# EAGLE design Rainer - V0 (EAGLE 7.3.0)

## Sheet 1 of 2
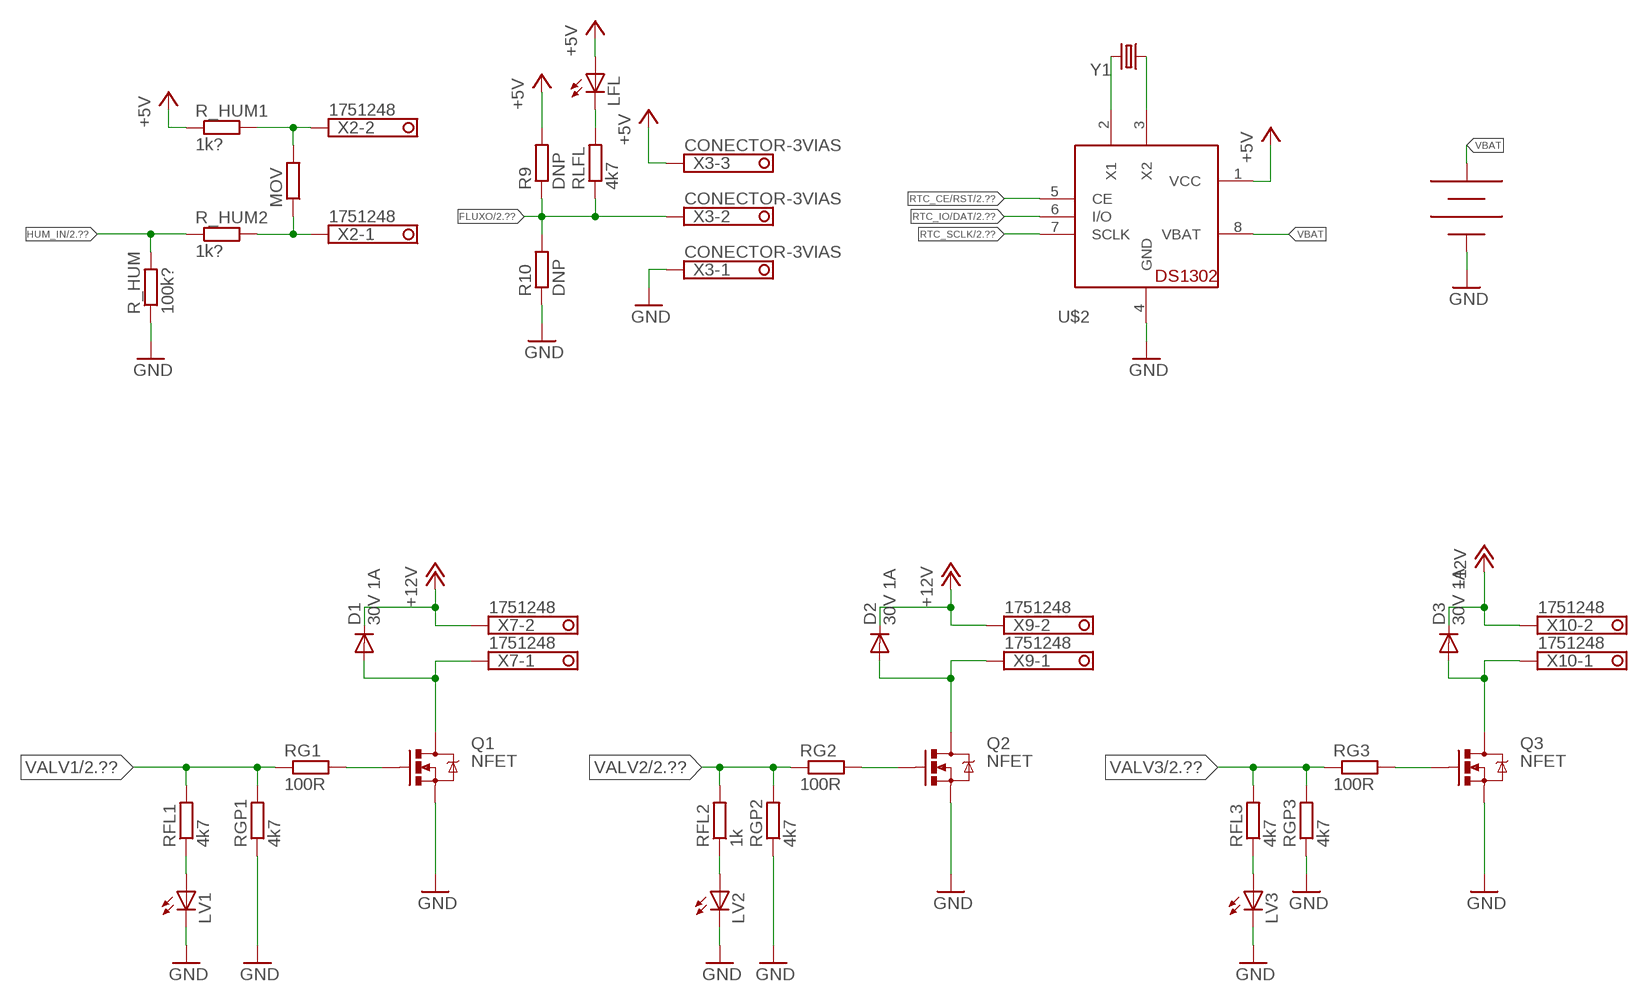
[diagram p0: schematic, sheet 1]

### Parts
D1  30V 1A  DIODE-DO214AC  [DO214AC]
D2  30V 1A  DIODE-DO214AC  [DO214AC]
D3  30V 1A  DIODE-DO214AC  [DO214AC]
LFL  LEDCHIP-LED0603  [CHIP-LED0603]
LV1  LEDCHIP-LED0603  [CHIP-LED0603]
LV2  LEDCHIP-LED0603  [CHIP-LED0603]
LV3  LEDCHIP-LED0603  [CHIP-LED0603]
MOV  R-EU_0207/7  [0207/7]
Q1  NFET  MOSFET-NCHANNELBSS138  [SOT23]
Q2  NFET  MOSFET-NCHANNELBSS138  [SOT23]
Q3  NFET  MOSFET-NCHANNELBSS138  [SOT23]
R9  DNP  R-EU_R0603  [R0603]
R10  DNP  R-EU_R0603  [R0603]
R_HUM  100k?  R-EU_R0603  [R0603]
R_HUM1  1k?  R-EU_R0603  [R0603]
R_HUM2  1k?  R-EU_R0603  [R0603]
RFL1  4k7  R-EU_R0603  [R0603]
RFL2  1k  R-EU_R0603  [R0603]
RFL3  4k7  R-EU_R0603  [R0603]
RG1  100R  R-EU_R0603  [R0603]
RG2  100R  R-EU_R0603  [R0603]
RG3  100R  R-EU_R0603  [R0603]
RGP1  4k7  R-EU_R0603  [R0603]
RGP2  4k7  R-EU_R0603  [R0603]
RGP3  4k7  R-EU_R0603  [R0603]
RLFL  4k7  R-EU_R0603  [R0603]
U$2  DS1302  [DIL08-ROUND]
U$4  CR2032  [CR2032-A]
X2  1751248  [1751248]
X3  CONECTOR-3VIAS  [3.5MM-3VIAS]
X7  1751248  [1751248]
X9  1751248  [1751248]
X10  1751248  [1751248]
Y1  CRYSTAL  [TC26V]

### Nets
+5V: LFL.A R9.2 R_HUM1.1 U$2.1(VCC) X3.3 ; also sheet 2
+12V: D1.C D2.C D3.C X7.2 X9.2 X10.2 ; also sheet 2
FLUXO: R9.1 R10.2 RLFL.1 X3.2 ; also sheet 2
GND: LV1.C LV2.C LV3.C Q1.2(S) Q2.2(S) Q3.2(S) R10.1 R_HUM.1 RGP1.1 RGP2.1 RGP3.1 U$2.4(GND) U$4.P$1 X3.1 ; also sheet 2
HUM_IN: R_HUM2.1 R_HUM.2 ; also sheet 2
N$2: MOV.2 R_HUM1.2 X2.2
N$4: MOV.1 R_HUM2.2 X2.1
N$5: LFL.C RLFL.2
N$6: Q1.1(G) RG1.2
N$8: U$2.2(X1) Y1.2
N$9: U$2.3(X2) Y1.1
N$10: D1.A Q1.3(D) X7.1
N$12: Q2.1(G) RG2.2
N$14: D2.A Q2.3(D) X9.1
N$15: Q3.1(G) RG3.2
N$17: D3.A Q3.3(D) X10.1
N$24: LV3.A RFL3.1
N$26: LV2.A RFL2.1
N$28: LV1.A RFL1.1
RTC_CE/RST: U$2.5(CE) ; also sheet 2
RTC_IO/DAT: U$2.6(I/O) ; also sheet 2
RTC_SCLK: U$2.7(SCLK) ; also sheet 2
VALV1: RFL1.2 RG1.1 RGP1.2 ; also sheet 2
VALV2: RFL2.2 RG2.1 RGP2.2 ; also sheet 2
VALV3: RFL3.2 RG3.1 RGP3.2 ; also sheet 2
VBAT: U$2.8(VBAT) U$4.P$2

## Sheet 2 of 2
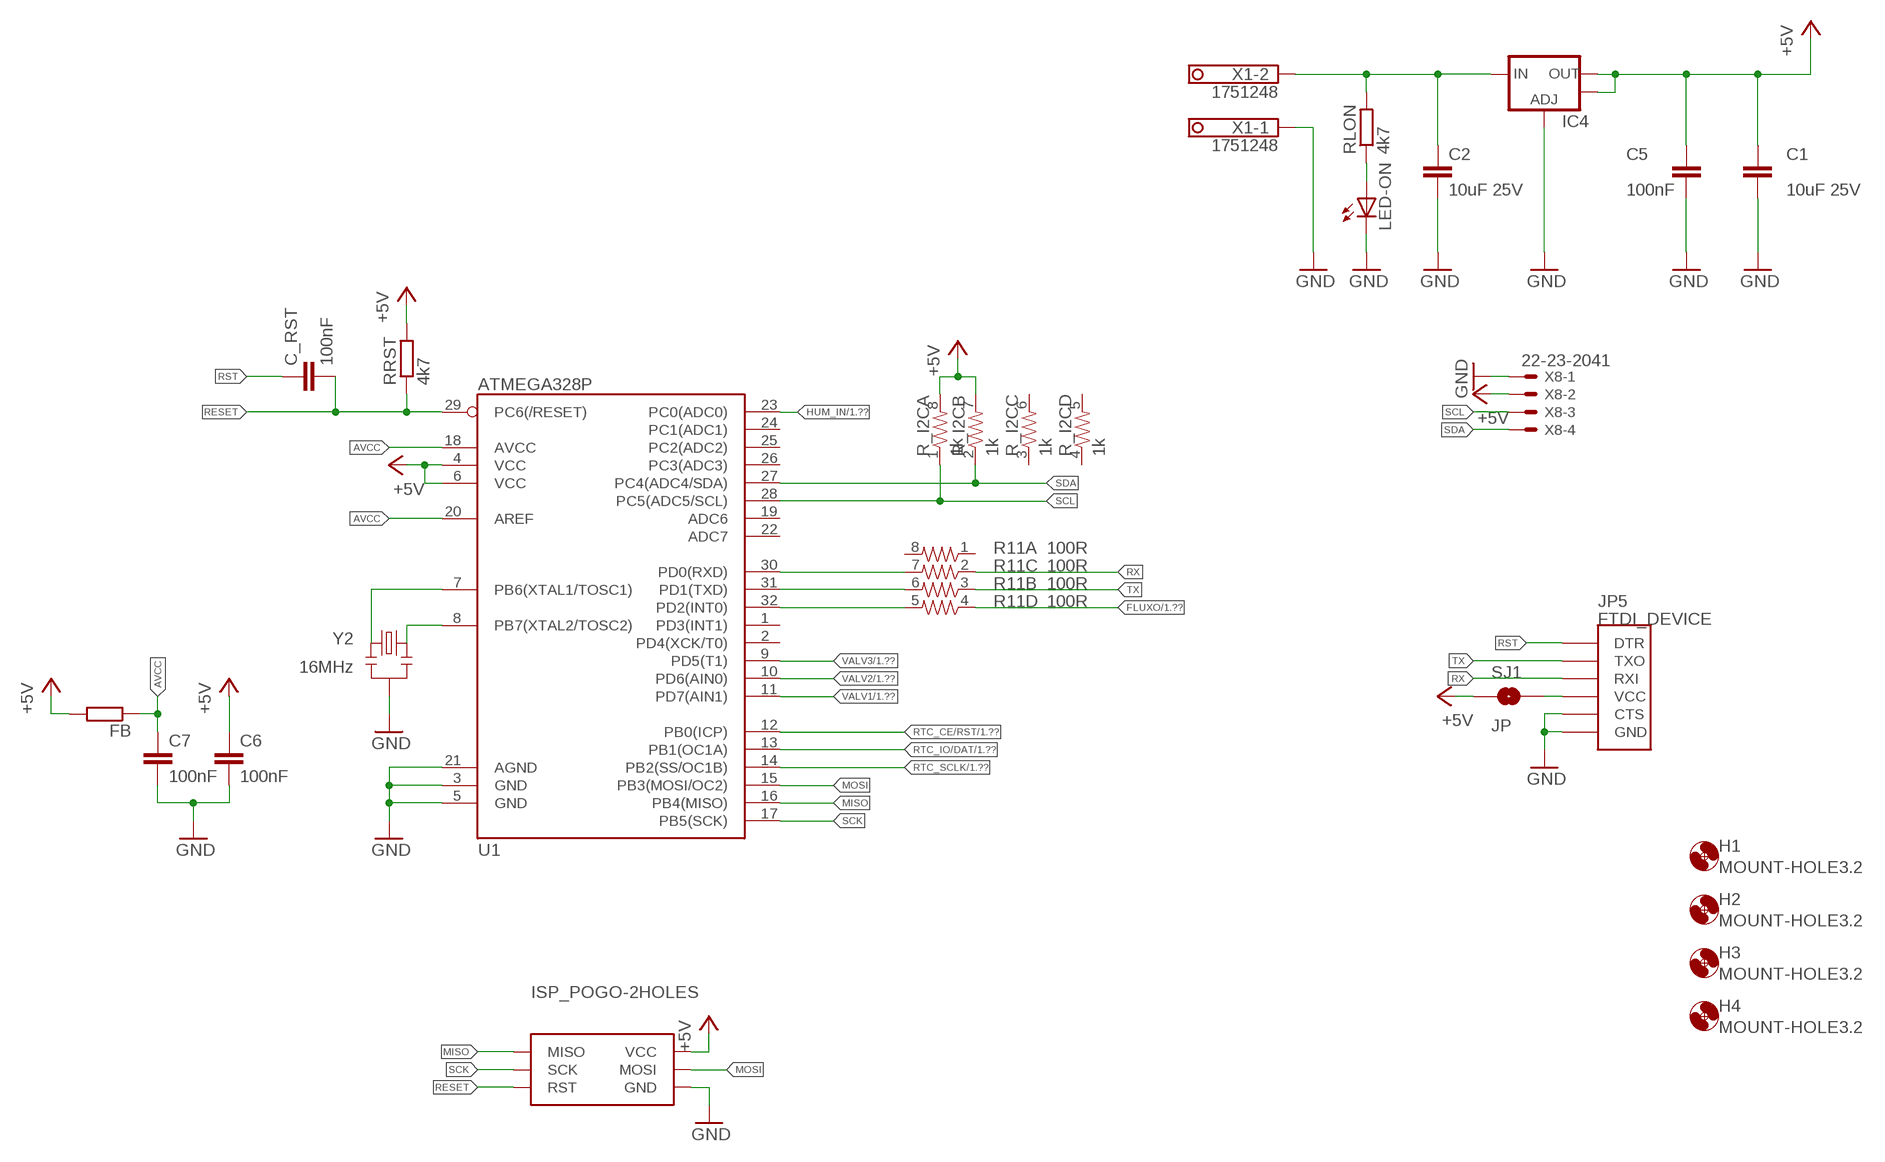
[diagram p1: schematic, sheet 2]

### Parts
C1  10uF 25V  C-EUC1210  [C1210]
C2  10uF 25V  C-EUC1210  [C1210]
C5  100nF  C-EUC0603  [C0603]
C6  100nF  C-EUC0603  [C0603]
C7  100nF  C-EUC0603  [C0603]
C_RST  100nF  C-EUC0603  [C0603]
FB  R-EU_R0603  [R0603]
H1  MOUNT-HOLE3.2  [3,2]
H2  MOUNT-HOLE3.2  [3,2]
H3  MOUNT-HOLE3.2  [3,2]
H4  MOUNT-HOLE3.2  [3,2]
IC4  V_REG_LM1117SOT223  [SOT223]
JP5  FTDI_DEVICE  [FTDI_DEVICE_SIDE]
LED-ON  LEDCHIP-LED0603  [CHIP-LED0603]
R11  100R  RESISTOR-ARRAY0603-ARV  [0603-ARV]
R_I2C  1k  RESISTOR-ARRAY0603-ARV  [0603-ARV]
RLON  4k7  R-EU_R0603  [R0603]
RRST  4k7  R-EU_R0603  [R0603]
SJ1  JP  SOLDERJUMPER-OLDNC2  [SJ_2S-NOTRACE]
U1  ATMEGA328P  ATMEGA328_SMT  [TQFP32-08]
U$1  ISP_POGO-2HOLES  [ISP_POGO]
X1  1751248  [1751248]
X8  22-23-2041  [22-23-2041]
Y2  16MHz  RESONATOR16MHZ  [RESONATOR-SMD]

### Nets
+5V: C1.1 C5.1 C6.1 FB.2 IC4.2(OUT) IC4.4(OUT) R_I2C.7 R_I2C.8 RRST.2 SJ1.1 U1.4(VCC) U1.6(VCC) U$1.VCC X8.2 ; also sheet 1
+12V: C2.1 IC4.3(IN) RLON.2 X1.2 ; also sheet 1
AVCC: C7.1 FB.1 U1.18(AVCC) U1.20(AREF)
FLUXO: R11.4 ; also sheet 1
GND: C1.2 C2.2 C5.2 C6.2 C7.2 IC4.1(ADJ) JP5.P$5(CTS) JP5.P$6(GND) LED-ON.C U1.3(GND) U1.5(GND) U1.21(AGND) U$1.GND X1.1 X8.1 Y2.2 ; also sheet 1
HUM_IN: U1.23(PC0(ADC0)) ; also sheet 1
MISO: U1.16(PB4(MISO)) U$1.MISO
MOSI: U1.15(PB3(MOSI/OC2)) U$1.MOSI
N$1: U1.7(PB6(XTAL1/TOSC1)) Y2.1
N$3: U1.8(PB7(XTAL2/TOSC2)) Y2.3
N$7: LED-ON.A RLON.1
N$11: R11.7 U1.30(PD0(RXD))
N$19: JP5.P$4(VCC) SJ1.2
N$21: R11.6 U1.31(PD1(TXD))
N$22: R11.5 U1.32(PD2(INT0))
RESET: C_RST.2 RRST.1 U1.29(PC6(/RESET)) U$1.RST
RST: C_RST.1 JP5.P$1(DTR)
RTC_CE/RST: U1.12(PB0(ICP)) ; also sheet 1
RTC_IO/DAT: U1.13(PB1(OC1A)) ; also sheet 1
RTC_SCLK: U1.14(PB2(SS/OC1B)) ; also sheet 1
RX: JP5.P$3(RXI) R11.2
SCK: U1.17(PB5(SCK)) U$1.SCK
SCL: R_I2C.1 U1.28(PC5(ADC5/SCL)) X8.3
SDA: R_I2C.2 U1.27(PC4(ADC4/SDA)) X8.4
TX: JP5.P$2(TXO) R11.3
VALV1: U1.11(PD7(AIN1)) ; also sheet 1
VALV2: U1.10(PD6(AIN0)) ; also sheet 1
VALV3: U1.9(PD5(T1)) ; also sheet 1
Unconnected: R11.1 R11.8 R_I2C.3 R_I2C.4 R_I2C.5 R_I2C.6 U1.1(PD3(INT1)) U1.2(PD4(XCK/T0)) U1.19(ADC6) U1.22(ADC7) U1.24(PC1(ADC1)) U1.25(PC2(ADC2)) U1.26(PC3(ADC3))

## Library data of the parts
C1 C2 C5-C7 C_RST = wes:C-EU: CAPACITOR, European symbol
D1-D3 = diode:DIODE-: DIODE
FB R9 R10 R_HUM R_HUM1 R_HUM2 RFL1-RFL3 RG1-RG3 RGP1-RGP3 RLFL RLON RRST = wes:R-EU_: RESISTOR, European symbol
H1-H4 = holes:MOUNT-HOLE: MOUNTING HOLE with drill center marker
IC4 = SparkFun-PowerIC:V_REG_LM1117: Voltage Regulator LM1117 Standard adjustable voltage regulator but in SMD form. Spark Fun Electronics SKU : COM-00595
JP5 = SparkFun-Connectors:FTDI_DEVICE: Connector which mates to FTDI basic or FTDI cable.
LED-ON LFL LV1-LV3 = led:LED: LED OSRAM: - CHIPLED LG R971, LG N971, LY N971, LG Q971, LY Q971, LO R971, LY R971 LH N974, LH R974 LS Q976, LO Q976, LY Q976 LO Q996 - Hyper CHIPLED LW Q18S LB Q993, LB Q99A, LB R99A - SideLED LS A670, LO A670, LY A670, LG A670, LP A670 LB A673, LV A673, LT A673, LW A673 LH A674 LY A675 LS A676, LA A676, LO A676, LY A676, LW A676 LS A679, LY A679, LG A679 - Hyper Micro SIDELED® LS Y876, LA Y876, LO Y876, LY Y876 LT Y87S - SmartLED LW L88C, LW L88S LB L89C, LB L89S, LG L890 LS L89K, LO L89K, LY L89K LS L896, LA L896, LO L896, LY L896 - TOPLED LS T670, LO T670, LY T670, LG T670, LP T670 LSG T670, LSP T670, LSY T670, LOP T670, LYG T670 LG T671, LOG T671, LSG T671 LB T673, LV T673, LT T673, LW T673 LH T674 LS T676, LA T676, LO T676, LY T676, LB T676, LH T676, LSB T676, LW T676 LB T67C, LV T67C, LT T67C, LS T67K, LO T67K, LY T67K, LW E67C LS E67B, LA E67B, LO E67B, LY E67B, LB E67C, LV E67C, LT E67C LW T67C LS T679, LY T679, LG T679 LS T770, LO T770, LY T770, LG T770, LP T770 LB T773, LV T773, LT T773, LW T773 LH T774 LS E675, LA E675, LY E675, LS T675 LS T776, LA T776, LO T776, LY T776, LB T776 LHGB T686 LT T68C, LB T68C - Hyper Mini TOPLED® LB M676 - Mini TOPLED Santana® LG M470 LS M47K, LO M47K, LY M47K Source: http://www.osram.convergy.de LUXEON: - LUMILED® LXK2-PW12-R00, LXK2-PW12-S00, LXK2-PW14-U00, LXK2-PW14-V00 LXK2-PM12-R00, LXK2-PM12-S00, LXK2-PM14-U00 LXK2-PE12-Q00, LXK2-PE12-R00, LXK2-PE12-S00, LXK2-PE14-T00, LXK2-PE14-U00 LXK2-PB12-K00, LXK2-PB12-L00, LXK2-PB12-M00, LXK2-PB14-N00, LXK2-PB14-P00, LXK2-PB14-Q00 LXK2-PR12-L00, LXK2-PR12-M00, LXK2-PR14-Q00, LXK2-PR14-R00 LXK2-PD12-Q00, LXK2-PD12-R00, LXK2-PD12-S00 LXK2-PH12-R00, LXK2-PH12-S00 LXK2-PL12-P00, LXK2-PL12-Q00, LXK2-PL12-R00 Source: www.luxeon.com KINGBRIGHT: KA-3528ASYC Source: www.kingbright.com
MOV = rcl:R-EU_: RESISTOR, European symbol
Q1-Q3 = SparkFun-DiscreteSemi:MOSFET-NCHANNEL: Common NMOSFET Parts MFG P/N Store ID Prod ID FDD8780 TRANS-09984 SI7820DN TRANS-11055 FDS6630A IC-08089 2N7002PW TRANS-11151 FQP30N06L COM-10213 TRANS-10060 BSS123LT1G TRANS-08345 BSS138 TRANS-00830 BS170 2N7000; PROD_ID: TRANS-00830
R11 R_I2C = SparkFun-Passives:RESISTOR-ARRAY: Array Chip Resistor Source: RS Component / Phycomp
SJ1 = SparkFun-Passives:SOLDERJUMPER-OLD: Solder Jumper Standard SMD solder jumper. Used to automate production. Two varients : Normally Open and Normally Closed are the same, but have different paste layers. NC will have a large amount of paste and should jumper during reflow.
U1 = SparkFun-DigitalIC:ATMEGA328_SMT: 32-Pin Atmega328 part Commonly used on Arduino compatible boards Available in QFP and QFN packages TQFP is IC-09069 QFN is non-stock; PROD_ID: IC-09069
U$1 = wes:ISP_POGO
U$2 = adafruit:DS1302: DS1302 - Real time clock with supercap trickle charger
U$4 = wes:CR2032
X1 X2 X7 X9 X10 = wes:1751248: MKDS 1/ 2-3,5 Printklemme Nennstrom: 10 A Bemessungsspannung: 160 V Raster: 3,5 mm Polzahl: 2 Montageart: Löten Anschlussart: Schraubanschluss Anschlussrichtung vom Leiter zur Platine: 0° Source: http://eshop.phoenixcontact.com .. 1751248.pdf; OC_FARNELL: unknown; OC_NEWARK: unknown
X3 = wes:CONECTOR-3VIAS: MKDS 1/ 2-3,5 Printklemme Nennstrom: 10 A Bemessungsspannung: 160 V Raster: 3,5 mm Polzahl: 2 Montageart: Löten Anschlussart: Schraubanschluss Anschlussrichtung vom Leiter zur Platine: 0° Source: http://eshop.phoenixcontact.com .. 1751248.pdf
X8 = con-molex:22-23-2041: .100" (2.54mm) Center Header - 4 Pin; MF: MOLEX; MPN: 22-23-2041; OC_FARNELL: 1462920; OC_NEWARK: 38C0355
Y1 = SparkFun-FreqCtrl:CRYSTAL: Various standard crystals. Proven footprints. Spark Fun Electronics SKU : COM-00534
Y2 = SparkFun-FreqCtrl:RESONATOR: Resonator Small SMD resonator. Used, eg, on the Arduino Pro/ Pro Mini boards. 8MHz- XTAL-08895 16MHz- XTAL-08900; PROD_ID: XTAL-08900

## Board
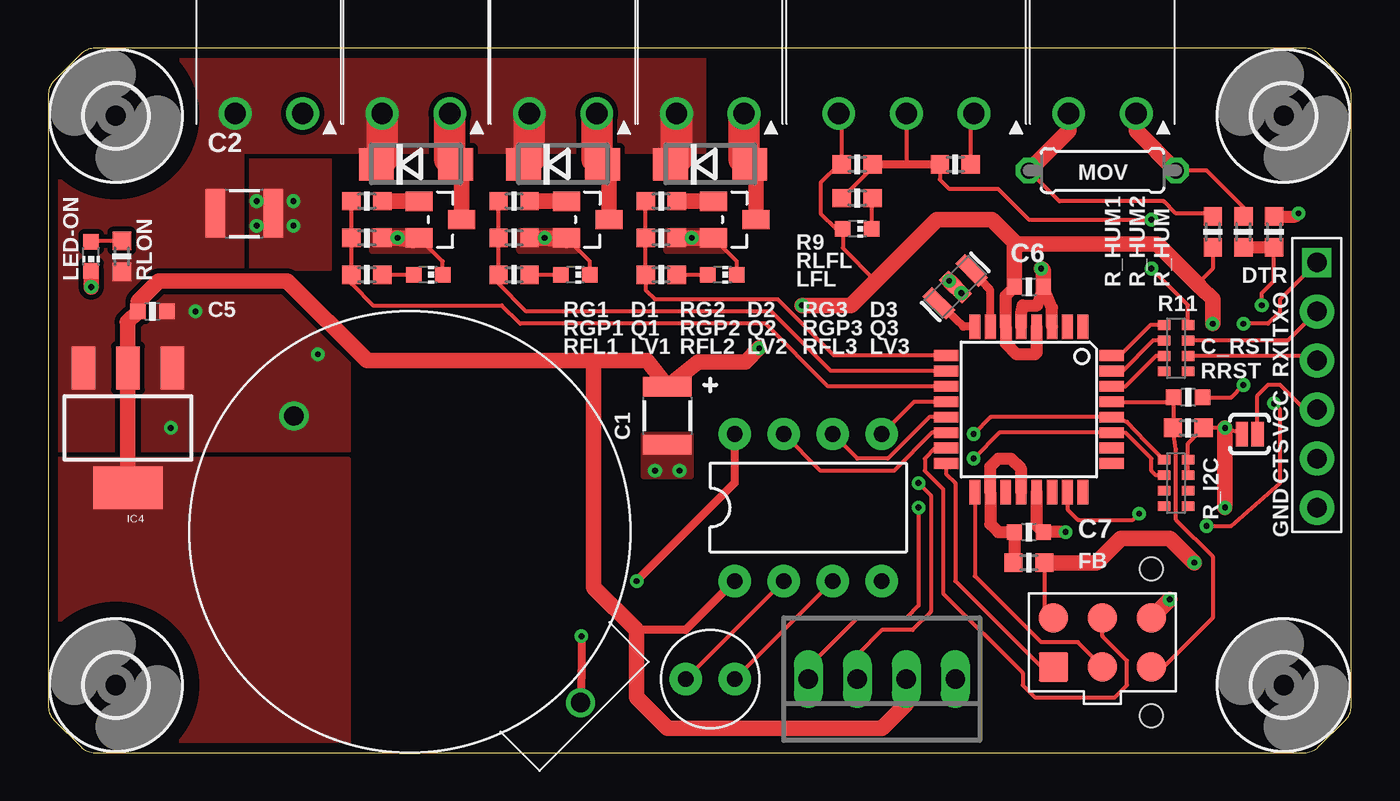
[diagram p2: board, top side]
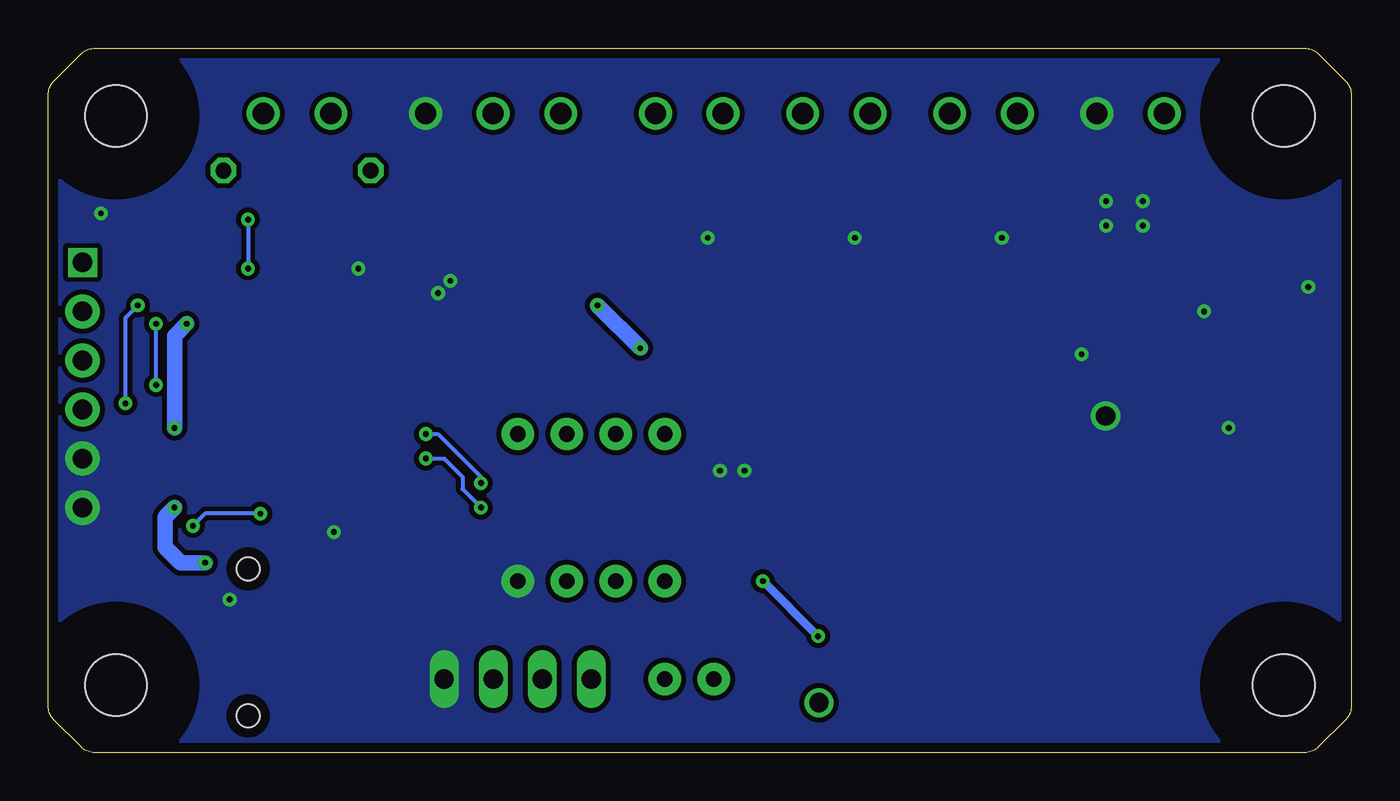
[diagram p3: board, bottom side, seen from below]

Size 67.5 x 36.5 mm. Coordinates in mm from the lower left corner, seen from the top.
Outline: 65.09,36.5 2.41,36.5 arc45 1.71,36.21 0.29,34.79 arc45 0,34.09 0,2.41 arc45 0.29,1.71 1.71,0.29 arc45 2.41,0 65.09,0 arc45 65.79,0.29 67.21,1.71 arc45 67.5,2.41 67.5,34.09 arc45 67.21,34.79 65.79,36.21 arc45 65.09,36.5
Copper layers (1*16): Top 0.035mm / dielectric 1.5mm / Bottom 0.035mm
Design rules "default *": minimum track width 6mil, minimum drill 0.29mm, track to track 7mil, track to pad 7mil, pad to pad 7mil, via to via 7mil, smd to smd 6mil, copper to edge 20mil, drill to drill 8mil, minimum pad ring 10mil, minimum via ring 8mil, stop-mask expansion 4mil, vias tented up to drill 0.3mm, thermal gap 10mil
tKeepout: 7 lines

### Footprints (pad centres in the part's own frame; a part is rotated, then mirrored left to right if it is on the bottom)
C1210 = smd 1 x 2.5: 1 -1.5,0; 2 1.5,0
C0603 = smd 0.8 x 0.8: 1 -0.75,0; 2 0.75,0
DO214AC = smd 1.8 x 1.7: A 2.05,0; C -2.05,0
R0603 = smd 0.95 x 0.95: 1 -0.8,0; 2 0.8,0
3,2 = hole 3.2: 0,0
SOT223 = smd 1.219 x 2.235: 1 -2.311,-3.099; 2 0,-3.099; 3 2.311,-3.099 | smd 3.6 x 2.2: 4 0,3.099
FTDI_DEVICE_SIDE = drill 1 square: P$1 -6.35,0 | drill 1.016 pad 1.778: P$2 -3.81,0; P$3 -1.27,0; P$4 1.27,0; P$5 3.81,0; P$6 6.35,0
CHIP-LED0603 = smd 0.8 x 0.8: A 0,-0.75; C 0,0.75
0207/7 = drill 0.813 octagon: 1 -3.81,0; 2 3.81,0
SOT23 = smd 1 x 1.4: 1 -0.95,-1.1; 2 0.95,-1.1; 3 0,1.1
0603-ARV = smd 0.5 x 0.65: 1 -1.2,-0.625; 2 -0.4,-0.625; 3 0.4,-0.625; 4 1.2,-0.625; 5 1.2,0.625; 6 0.4,0.625; 7 -0.4,0.625; 8 -1.2,0.625
SJ_2S-NOTRACE = smd 0.635 x 1.27: 1 -0.401,0; 2 0.413,0
TQFP32-08 = smd 1.27 x 0.559: 1 -4.293,2.8; 2 -4.293,2; 3 -4.293,1.2; 4 -4.293,0.4; 5 -4.293,-0.4; 6 -4.293,-1.2; 7 -4.293,-2; 8 -4.293,-2.8; 17 4.293,-2.8; 18 4.293,-2; 19 4.293,-1.2; 20 4.293,-0.4; 21 4.293,0.4; 22 4.293,1.2; 23 4.293,2; 24 4.293,2.8 | smd 0.559 x 1.27: 9 -2.8,-4.293; 10 -2,-4.293; 11 -1.2,-4.293; 12 -0.4,-4.293; 13 0.4,-4.293; 14 1.2,-4.293; 15 2,-4.293; 16 2.8,-4.293; 25 2.8,4.293; 26 2,4.293; 27 1.2,4.293; 28 0.4,4.293; 29 -0.4,4.293; 30 -1.2,4.293; 31 -2,4.293; 32 -2.8,4.293
ISP_POGO = smd 1.524 x 1.524: GND 1.27,-2.54; MISO -1.27,2.54; MOSI 1.27,0; RST -1.27,-2.54; SCK -1.27,0; VCC 1.27,2.54 | hole 1.2: -3.81,-2.54; 3.81,-2.54
DIL08-ROUND = drill 0.813 pad 1.676: 1 -3.81,-3.81; 2 -1.27,-3.81; 3 1.27,-3.81; 4 3.81,-3.81; 5 3.81,3.81; 6 1.27,3.81; 7 -1.27,3.81; 8 -3.81,3.81
CR2032-A = drill 1: P$1 0,8.5; P$2 0,-12.5
1751248 = drill 1.1 pad 1.7: 1 -1.75,-0.1; 2 1.75,-0.1
3.5MM-3VIAS = drill 1.1 pad 1.7: 1 -3.5,-0.1; 2 0,-0.1; 3 3.5,-0.1
22-23-2041 = drill 1 long: 1 -3.81,0; 2 -1.27,0; 3 1.27,0; 4 3.81,0
TC26V = drill 0.813 pad 1.676: 1 -1.27,0; 2 1.27,0
RESONATOR-SMD = smd 0.7 x 1.7: 1 -1.2,0; 2 0,0; 3 1.2,0

### Placement (x,y rotation side)
C1  32.07,17.46 270 top
C2  10.16,27.94 0 top
C5  5.4,22.86 0 top
C6  50.8,24.13 0 top
C7  50.8,11.43 0 top
C_RST  59.05,18.41 180 top
D1  19.05,30.48 0 top
D2  26.67,30.48 0 top
D3  34.29,30.48 0 top
FB  50.8,9.84 0 top
H1  3.5,33 90 top
H2  3.5,3.5 90 top
H3  64,3.5 90 top
H4  64,33 90 top
IC4  4.13,16.83 180 top
JP5  65.72,19.05 270 top
LED-ON  2.22,25.72 180 top
LFL  41.91,27.15 270 top
LV1  19.68,24.77 270 top
LV2  27.3,24.77 270 top
LV3  34.92,24.77 270 top
MOV  54.61,30.16 180 top
Q1  20.32,27.62 270 top
Q2  27.94,27.62 270 top
Q3  35.56,27.62 270 top
R9  41.91,30.48 180 top
R10  46.99,30.48 180 top
R11  58.42,20.95 90 top
R_HUM  63.5,26.99 270 top
R_HUM1  60.33,26.99 90 top
R_HUM2  61.91,26.99 90 top
R_I2C  58.42,13.97 270 top
RFL1  16.51,24.77 180 top
RFL2  24.13,24.77 180 top
RFL3  31.75,24.77 180 top
RG1  16.51,28.57 0 top
RG2  24.13,28.57 0 top
RG3  31.75,28.57 0 top
RGP1  16.51,26.67 180 top
RGP2  24.13,26.67 180 top
RGP3  31.75,26.67 180 top
RLFL  41.91,28.73 0 top
RLON  3.81,25.72 270 top
RRST  59.05,16.83 0 top
SJ1  62.23,16.51 0 top
U1  50.8,17.78 270 top
U$1  54.61,5.71 90 top
U$2  39.37,12.7 0 top
U$4  18.73,11.43 45 top
X1  11.43,33.02 180 top
X2  54.61,33.02 180 top
X3  44.45,33.02 180 top
X7  19.05,33.02 180 top
X8  43.18,3.81 180 top
X9  26.67,33.02 180 top
X10  34.29,33.02 180 top
Y1  34.29,3.81 180 top
Y2  46.99,24.13 225 top

### Tracks (layer width: path | path; a pad name or v marks a point on that pad's centre or on a via)
+5V  (via drill 0.3)
  Top 0.203: SJ1.1 v60.96,16.83 RRST.2 59.05,16.02 R_I2C.8 R_I2C.7 | R_HUM1.1 60.33,25.08 59.69,24.45 59.69,24.13 | FB.2 51.6,7.46 arc90 U$1.VCC | X3.3 41.11,32.96 R9.2 40.96,30.48 40.01,29.53 40.01,27.94 40.8,27.15 LFL.A 41.16,26.15 42.86,24.45
  Top 0.406: 51.2,20.72 51.12,20.64 | U$2.1 33.02,6.35 30.48,6.35
  Top 0.61: U1.4 51.2,20.72 | 51.12,20.64 50.16,20.64 49.6,21.2 U1.6 49.6,23.68 C6.1
  Top 0.813: v60.33,22.23 60.33,23.5 59.69,24.13 57.47,26.35 50.05,26.35 | v60.96,16.83 v60.96,12.7 | 28.26,20.32 16.51,20.32 12.38,24.45 5.71,24.45 4.65,23.38 C5.1 4.1,22.32 4.13,22.29 IC4.2 IC4.4 | 28.26,20.32 31.03,20.32 C1.1 33.66,20.23 36.11,20.23 v36.83,20.95 | v39.05,23.18 41.59,23.18 42.86,24.45 46.04,27.62 48.9,27.62 50.05,26.47 50.05,26.35 | C6.1 50.05,26.35 | 28.26,20.32 28.26,8.57 30.48,6.35 30.48,2.86 32.07,1.27 43.18,1.27 44.45,2.54 X8.2 | v59.37,9.84 58.1,11.11 55.56,11.11 54.29,9.84 FB.2
  Bottom 0.813: v59.37,9.84 60.64,9.84 61.44,10.64 61.44,12.22 v60.96,12.7 | v36.83,20.95 v39.05,23.18 | v60.96,16.83 60.96,21.59 v60.33,22.23
  pour Top (isolate 0.254, no thermals): -1.27,15.24 15.56,15.24 15.56,-2.86 -1.27,-2.86
+12V
  Top 0.813: 17.3,30.78 D1.C | 24.92,30.78 D2.C | 32.54,30.78 D3.C
  Top 1.626: 17.3,30.78 X7.2 | 24.92,30.78 X9.2 | 32.54,30.78 X10.2
  pour Top (isolate 0.254, no thermals): 6.35,40.64 33.97,40.64 33.97,31.11 6.35,31.11
  pour Top (isolate 0.254, rank 4, no thermals): 14.61,38.1 14.61,15.56 -1.27,15.56 -1.27,38.1
AVCC
  Top 0.61: U1.20 50.4,14.69 49.85,15.24 49.21,15.24 48.8,14.83 U1.18 48.8,11.84 49.21,11.43 C7.1 50.05,9.89 FB.1
FLUXO  (via drill 0.3)
  Top 0.203: R11.4 59.05,23.19 v57.15,25.08 | R9.1 42.71,30.33 RLFL.1 | R10.2 46.19,29.69 46.67,29.21 49.21,29.21 50.8,27.62 v57.15,27.62 | X3.2 44.45,30.48
  Top 0.406: R10.2 44.45,30.48 R9.1
  Bottom 0.203: v57.15,27.62 v57.15,25.08
GND  (via drill 0.3)
  Top 0.203: LV3.C 35.67,25.46 Q3.2 | LV2.C 28.05,25.46 Q2.2 | LV1.C 20.43,25.46 Q1.2 | R10.1 47.79,32.96 X3.1
  Top 0.61: U1.21 51.2,11.78 C7.2 v52.7,11.43 | U1.3 52,23.05 C6.2 51.23,23.18 50.48,23.18 50.4,22.78 U1.5 | R_HUM.1 64.62,27.79 v64.77,27.94
  Top 0.813: C6.2 51.55,24.97 v51.44,25.08 | Q3.2 32.87,26.67 RGP3.1 | RGP2.1 25.25,26.67 Q2.2 26.84,26.52 v25.72,26.67 | RGP1.1 17.63,26.67 Q1.2 18.9,26.52 v18.1,26.67 | U$1.GND v58.1,7.94 | Y2.2 v46.67,24.45 | LED-ON.C v2.22,24.13
  other vias: 33.34,26.67 32.7,14.61 31.43,14.61 12.7,28.57 6.35,16.83 7.62,22.86 10.79,28.57 10.79,27.3 12.7,27.3 13.97,20.64 47.31,23.81
  pour Bottom (isolate 0.254, no thermals): 0,40.64 67.31,40.64 67.31,-2.54 0,-2.54
  pour Top (no thermals): 16.83,26.99 19.68,26.99 19.68,26.04 16.83,26.04
  pour Top (no thermals): 24.45,26.99 27.3,26.99 27.3,26.04 24.45,26.04
  pour Top (no thermals): 32.07,26.99 34.92,26.99 34.92,26.04 32.07,26.04
  pour Top (no thermals): 30.8,16.51 30.8,14.29 33.34,14.29 33.34,16.51
  pour Top (isolate 0.254, rank 2, no thermals): 10.48,30.8 10.48,25.08 14.61,25.08 14.61,30.8
  pour Top (isolate 0.254, rank 2, no thermals): 4.76,15.56 4.76,23.81 12.38,23.81 15.56,20.64 15.56,15.56
HUM_IN  (via drill 0.3)
  Top 0.203: U1.23 52.8,12.61 53.34,12.06 56.2,12.06 v56.52,12.38 | v60.01,11.75 61.28,11.75 63.82,13.97 63.82,17.78 v63.5,18.1 | v62.87,23.18 62.87,23.81 63.5,24.45 R_HUM.2
  Top 0.61: R_HUM2.1 R_HUM.2
  Bottom 0.203: v56.52,12.38 59.37,12.38 v60.01,11.75 | v63.5,18.1 63.5,22.54 v62.87,23.18
MISO
  Top 0.203: U1.16 46.51,14.45 46.99,13.97 46.99,8.89 51.44,4.45 U$1.MISO
MOSI
  Top 0.203: U1.15 45.94,15.78 45.4,15.24 45.4,14.61 46.35,13.65 46.35,8.26 50.48,4.13 50.48,3.49 51.12,2.86 55.24,2.86 55.88,3.49 55.88,4.76 54.61,6.03 U$1.MOSI
N$1
  Top 0.406: U1.7 48.8,23.96 Y2.1
N$2
  Top 0.203: MOV.2 52.39,28.57 57.78,28.57 58.42,27.94 60.17,27.94 R_HUM1.2
  Top 0.813: X2.2 52.86,32.22 MOV.2
N$3
  Top 0.406: U1.8 47.41,22.07 Y2.3
N$4
  Top 0.203: R_HUM2.2 61.91,28.26 60.01,30.16 MOV.1
  Top 0.813: X2.1 56.36,32.22 MOV.1
N$5
  Top 0.203: LFL.C 42.66,28.68 RLFL.2
N$6
  Top 0.813: Q1.1 17.63,28.57 RG1.2
N$7
  Top 0.203: RLON.1 2.27,26.52 LED-ON.A
N$8
  Top 0.203: U$2.2 Y1.2
N$9
  Top 0.203: U$2.3 Y1.1
N$10
  Top 0.813: 20.8,30.78 D1.A 21.42,30.16 Q1.3
  Top 1.626: 20.8,30.78 X7.1
N$11
  Top 0.203: U1.30 55.81,18.98 57.38,20.55 R11.7
N$12
  Top 0.813: Q2.1 25.25,28.57 RG2.2
N$14
  Top 0.813: 28.42,30.78 D2.A 29.04,30.16 Q2.3
  Top 1.626: 28.42,30.78 X9.1
N$15
  Top 0.813: Q3.1 32.87,28.57 RG3.2
N$17
  Top 0.813: 36.04,30.78 D3.A 36.66,30.16 Q3.3
  Top 1.626: 36.04,30.78 X10.1
N$19
  Top 0.203: JP5.P$4 65.09,17.78 63.82,19.05 63.18,19.05 62.64,18.51 SJ1.2
N$21
  Top 0.203: U1.31 55.66,19.78 57.23,21.36 R11.6
N$22
  Top 0.203: U1.32 55.51,20.58 57.08,22.16 R11.5
N$24
  Top 0.203: RFL3.1 LV3.A
N$26
  Top 0.203: RFL2.1 LV2.A
N$28
  Top 0.203: RFL1.1 LV1.A
RESET
  Top 0.203: U1.29 58.07,18.18 C_RST.2 | 58.43,18.54 C_RST.2 | C_RST.2 58.3,18.46 RRST.1 58.42,15.71 58.42,12.06 60.33,10.16 60.33,6.99 57.78,4.45 U$1.RST
RST  (via drill 0.3)
  Top 0.203: C_RST.1 61.28,18.41 v61.91,19.05 | JP5.P$1 63.82,23.5 63.82,22.86 63.18,22.23 v61.91,22.23
  Bottom 0.203: v61.91,19.05 v61.91,22.23
RTC_CE/RST
  Top 0.203: U1.12 44.85,18.18 U$2.5
RTC_IO/DAT
  Top 0.203: U1.13 45.64,17.38 43.5,15.24 41.91,15.24 U$2.6
RTC_SCLK
  Top 0.203: U1.14 45.79,16.58 43.81,14.61 40.01,14.61 U$2.7
RX
  Top 0.203: JP5.P$3 65.49,20.55 R11.2
SCK
  Top 0.203: U$1.SCK 53.34,5.71 51.44,5.71 48,9.15 U1.17
SCL  (via drill 0.3)
  Top 0.203: R_I2C.1 56.83,16.13 55.88,17.14 55.33,17.38 U1.28 48.81,17.38 v47.94,16.51 | X8.3 41.91,5.08 43.18,6.35 44.77,6.35 45.72,7.3 45.72,13.34 v45.09,13.97
  Bottom 0.203: v47.94,16.51 47.31,16.51 45.09,14.29 v45.09,13.97
SDA  (via drill 0.3)
  Top 0.203: R_I2C.2 57.38,14.37 57.15,14.61 57.15,15.24 55.81,16.58 U1.27 49.28,16.58 v47.94,15.24 | X8.4 39.37,4.45 41.91,6.99 44.45,6.99 45.09,7.62 v45.09,12.7
  Bottom 0.203: v47.94,15.24 46.99,15.24 46.04,14.29 46.04,13.65 v45.09,12.7
TX
  Top 0.203: JP5.P$2 64.22,21.36 R11.3
VALV1
  Top 0.203: RG1.1 RGP1.2 RFL1.2 15.71,24.3 16.83,23.18 23.5,23.18 24.45,22.23 37.15,22.23 40.39,18.98 U1.11
VALV2
  Top 0.203: RG2.1 RGP2.2 RFL2.2 23.33,24.3 24.77,22.86 37.47,22.86 40.55,19.78 U1.10
VALV3
  Top 0.203: RG3.1 RGP3.2 RFL3.2 30.95,23.98 31.43,23.5 37.78,23.5 40.7,20.58 U1.9
VBAT  (via drill 0.3)
  Top 0.406: U$2.8 35.56,13.97 v30.48,8.89 | v27.62,6.03 27.62,4.23 U$4.P$2
  Bottom 0.406: v27.62,6.03 v30.48,8.89

### Text on the board
201bmp: HORTA URBANA | AUTOMATIZADA | RAINER | GRASSMANN